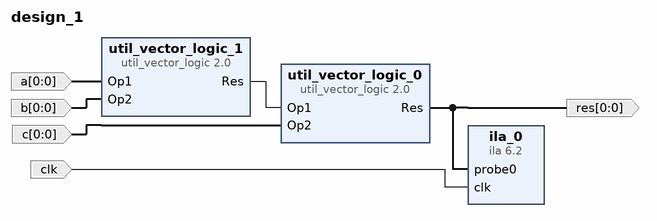
[diagram p0: block diagram of the top level]
# Vivado block design design_1, xc7a100tcsg324-1, Vivado 2018.3
create_bd_design design_1

create_bd_port -dir I -from 0 -to 0 a
create_bd_port -dir I -from 0 -to 0 b
create_bd_port -dir I -from 0 -to 0 c
create_bd_port -dir I -type clk clk
create_bd_port -dir O -from 0 -to 0 res

create_bd_cell -type ip -vlnv xilinx.com:ip:util_vector_logic:2.0 util_vector_logic_0
set_property -dict {CONFIG.C_SIZE 1} [get_bd_cells util_vector_logic_0]
create_bd_cell -type ip -vlnv xilinx.com:ip:util_vector_logic:2.0 util_vector_logic_1
set_property -dict {CONFIG.C_OPERATION xor CONFIG.C_SIZE 1} [get_bd_cells util_vector_logic_1]
create_bd_cell -type ip -vlnv xilinx.com:ip:ila:6.2 ila_0
set_property -dict {CONFIG.C_ENABLE_ILA_AXI_MON false CONFIG.C_MONITOR_TYPE Native CONFIG.C_NUM_OF_PROBES 1} [get_bd_cells ila_0]

# ---- connections ----

connect_bd_net -net Op1_0_1 [get_bd_ports a] [get_bd_pins util_vector_logic_1/Op1]
connect_bd_net -net Op2_0_1 [get_bd_ports b] [get_bd_pins util_vector_logic_1/Op2]
connect_bd_net [get_bd_pins util_vector_logic_1/Res] [get_bd_pins util_vector_logic_0/Op1]
connect_bd_net -net Op2_0_2 [get_bd_ports c] [get_bd_pins util_vector_logic_0/Op2]
connect_bd_net -net clk_0_1 [get_bd_ports clk] [get_bd_pins ila_0/clk]
connect_bd_net [get_bd_pins util_vector_logic_0/Res] [get_bd_ports res] [get_bd_pins ila_0/probe0]

validate_bd_design
save_bd_design
